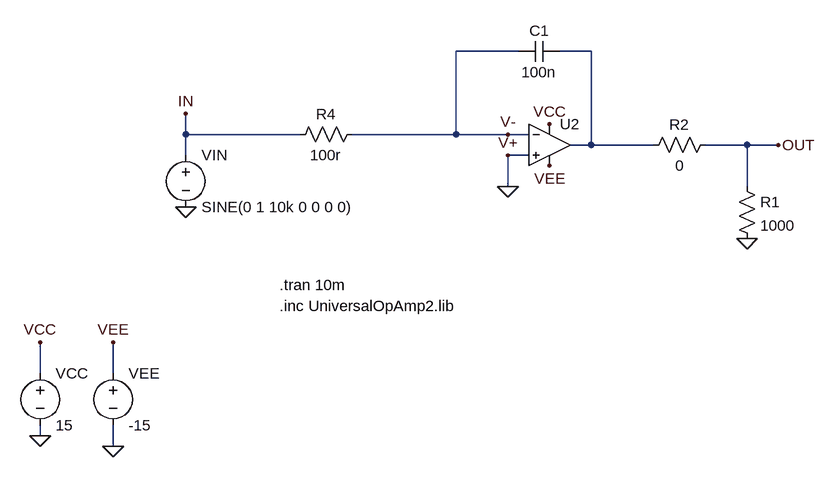
[diagram p0: schematic integrating-opamp.asc]
integrating-opamp.asc, the LTspice schematic file:
Version 4
SHEET 1 1360 680
WIRE 112 48 16 48
WIRE 224 48 176 48
WIRE -400 176 -400 144
WIRE -224 176 -400 176
WIRE 16 176 16 48
WIRE 16 176 -144 176
WIRE 96 176 16 176
WIRE 128 176 96 176
WIRE 224 192 224 48
WIRE 224 192 192 192
WIRE 320 192 224 192
WIRE 464 192 400 192
WIRE 512 192 464 192
WIRE -400 208 -400 176
WIRE 128 208 96 208
WIRE 96 256 96 208
WIRE 464 256 464 192
WIRE -624 544 -624 496
WIRE -512 544 -512 496
WIRE -624 640 -624 624
WIRE -512 656 -512 624
FLAG -624 640 0
FLAG -512 656 0
FLAG -400 288 0
FLAG 464 336 0
FLAG 512 192 OUT
FLAG -400 144 IN
FLAG -512 496 VEE
FLAG -624 496 VCC
FLAG 160 224 VEE
FLAG 160 160 VCC
FLAG 96 176 V-
FLAG 96 208 V+
FLAG 96 256 0
SYMBOL voltage -512 528 R0
SYMATTR InstName VEE
SYMATTR Value -15
SYMBOL voltage -624 528 R0
WINDOW 123 0 0 Left 0
WINDOW 39 0 0 Left 0
SYMATTR InstName VCC
SYMATTR Value 15
SYMBOL voltage -400 192 R0
WINDOW 123 0 0 Left 0
WINDOW 39 0 0 Left 0
SYMATTR InstName VIN
SYMATTR Value SINE(0 1 10k 0 0 0 0)
SYMBOL res 448 240 R0
SYMATTR InstName R1
SYMATTR Value 1000
SYMBOL res 416 176 R90
WINDOW 0 0 56 VBottom 2
WINDOW 3 32 56 VTop 2
SYMATTR InstName R2
SYMATTR Value 0
SYMBOL OpAmps\\UniversalOpamp2 160 192 R0
SYMATTR InstName U2
SYMBOL res -128 160 R90
WINDOW 0 0 56 VBottom 2
WINDOW 3 32 56 VTop 2
SYMATTR InstName R4
SYMATTR Value 100r
SYMBOL cap 176 32 R90
WINDOW 0 0 32 VBottom 2
WINDOW 3 32 32 VTop 2
SYMATTR InstName C1
SYMATTR Value 100n
TEXT -256 440 Left 2 !.inc UniversalOpAmp2.lib
TEXT -256 408 Left 2 !.tran 10m

The netlist it stands for:
* integrating-opamp.asc
VEE VEE 0 -15
VCC VCC 0 15
VIN IN 0 SINE(0 1 10k 0 0 0 0)
R1 OUT 0 1000
R2 OUT N001 0
XU2 0 V- VCC VEE N001 level.2 Avol=1Meg GBW=10Meg Slew=10Meg ilimit=25m rail=0 Vos=0 phimargin=45 en=0 enk=0 in=0 ink=0 Rin=500Meg  ; pins IN+ IN- V+ V- OUT
R4 V- IN 100r
C1 N001 V- 100n
.inc UniversalOpAmp2.lib
.tran 10m
.lib UniversalOpamps2.sub
.backanno
.end